# EAGLE design 242_arrayrelay (EAGLE 9.6.2)

## Sheet 1 of 4
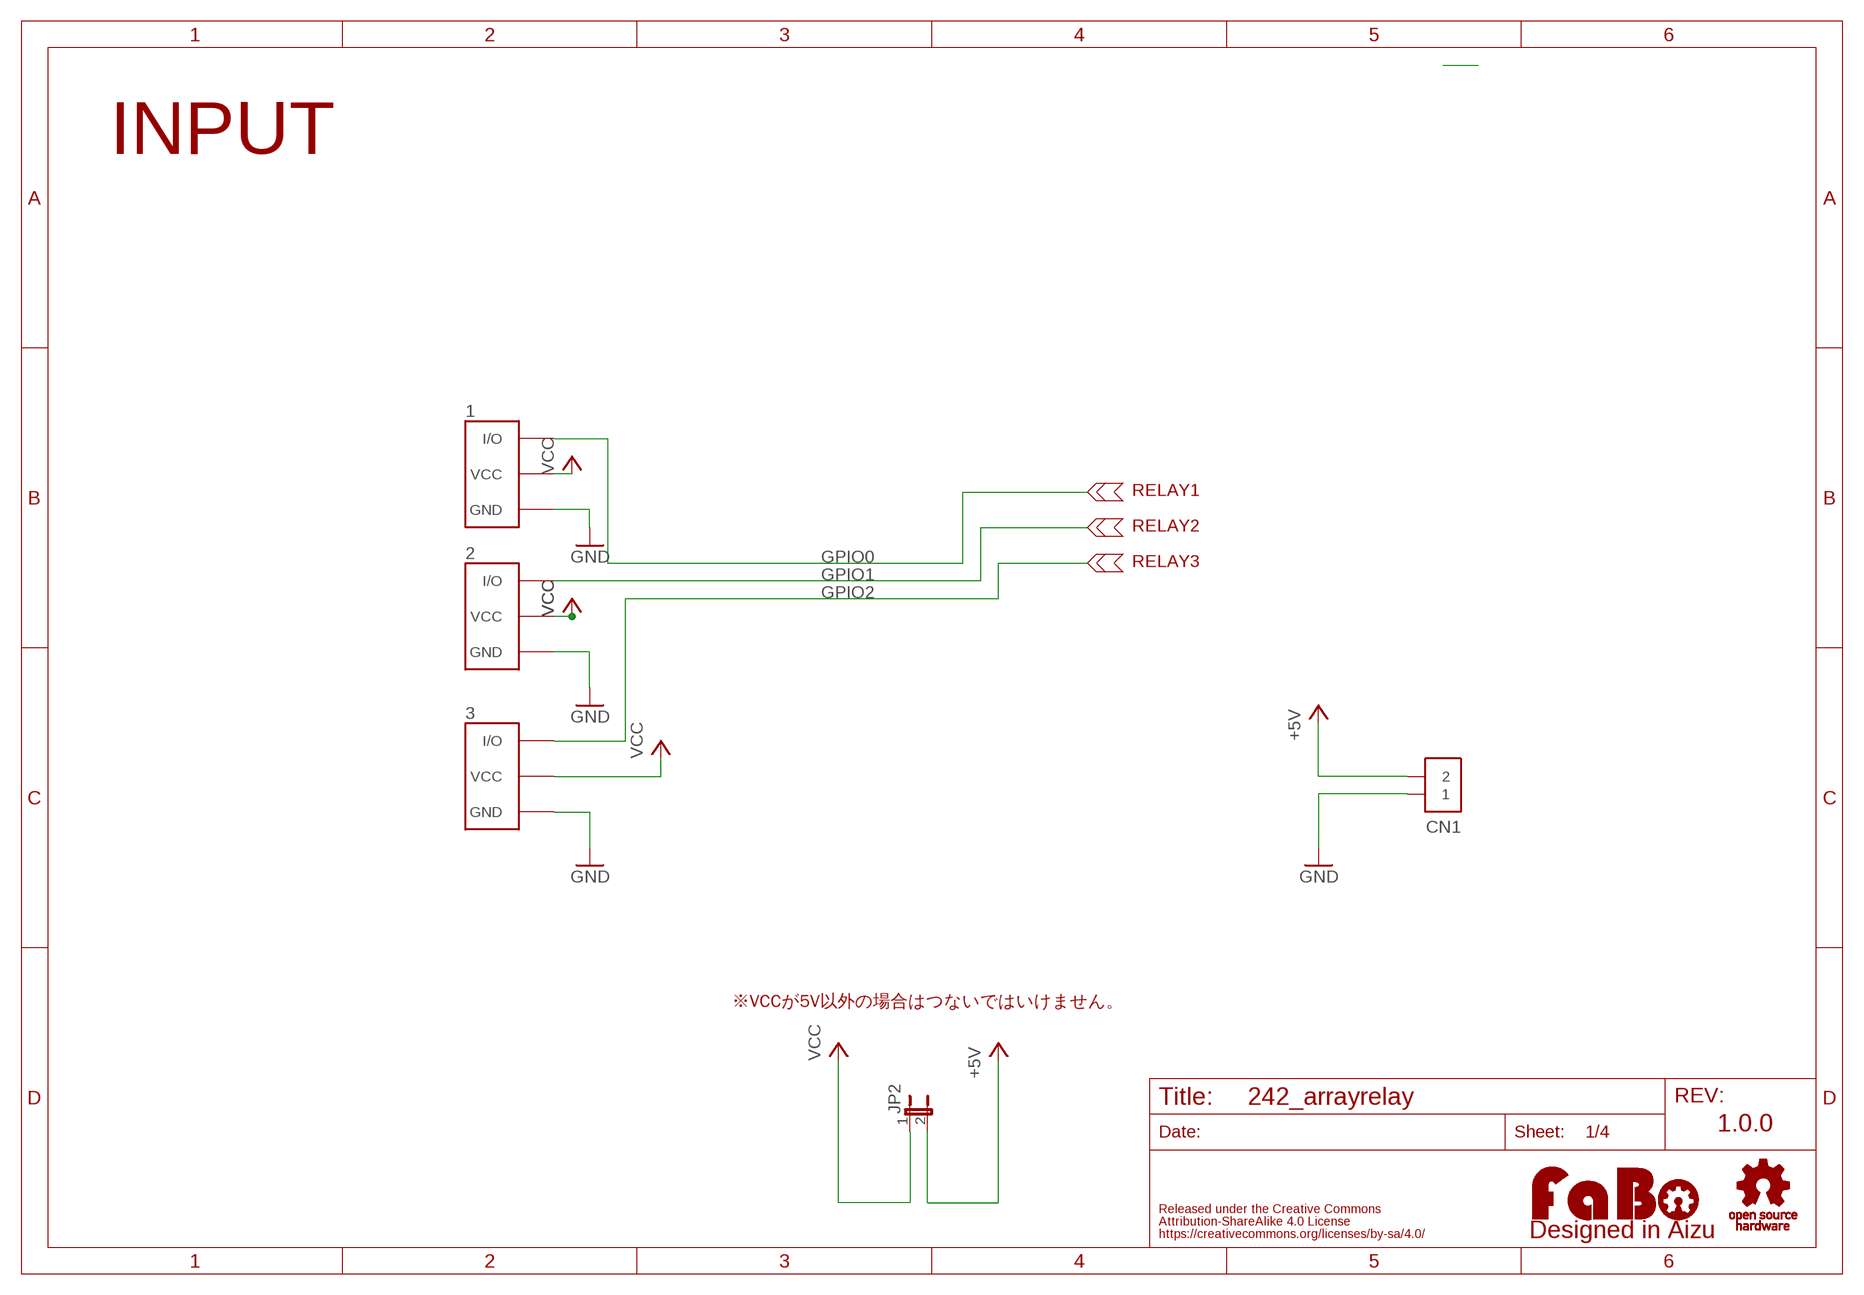
[diagram p0: schematic, sheet 1]

### Parts
1  FABO_BRICK_3PIN-S03B-PASK-2  [FABO_BRICK_3PIN_S03B-PASK-2]
2  FABO_BRICK_3PIN-S03B-PASK-2  [FABO_BRICK_3PIN_S03B-PASK-2]
3  FABO_BRICK_3PIN-S03B-PASK-2  [FABO_BRICK_3PIN_S03B-PASK-2]
CN1  PIN_HEADER_1X2  [PIN_1X2]
JP2  JP1E  [JP1]
LOGO1  LOGO_FABO-M  [LOGO_FABO_M]
U$2  LOGO_OSHW-M_BOTTOM  [LOGO_OSHW_M_BOTTOM]

### Nets
+5V: CN1.2 JP2.2 ; also sheet 2,3,4
GND: 1.GND 2.GND 3.GND CN1.1 ; also sheet 2,3,4
GPIO0: 1.I/O ; also sheet 2
GPIO1: 2.I/O ; also sheet 3
GPIO2: 3.I/O ; also sheet 4
VCC: 1.VCC 2.VCC 3.VCC JP2.1 ; also sheet 2,3,4

### Notes on the sheet
- INPUT
- RELAY1
- RELAY2
- RELAY3
- ※VCCが5V以外の場合はつないではいけません。
- 1.0.0

## Sheet 2 of 4
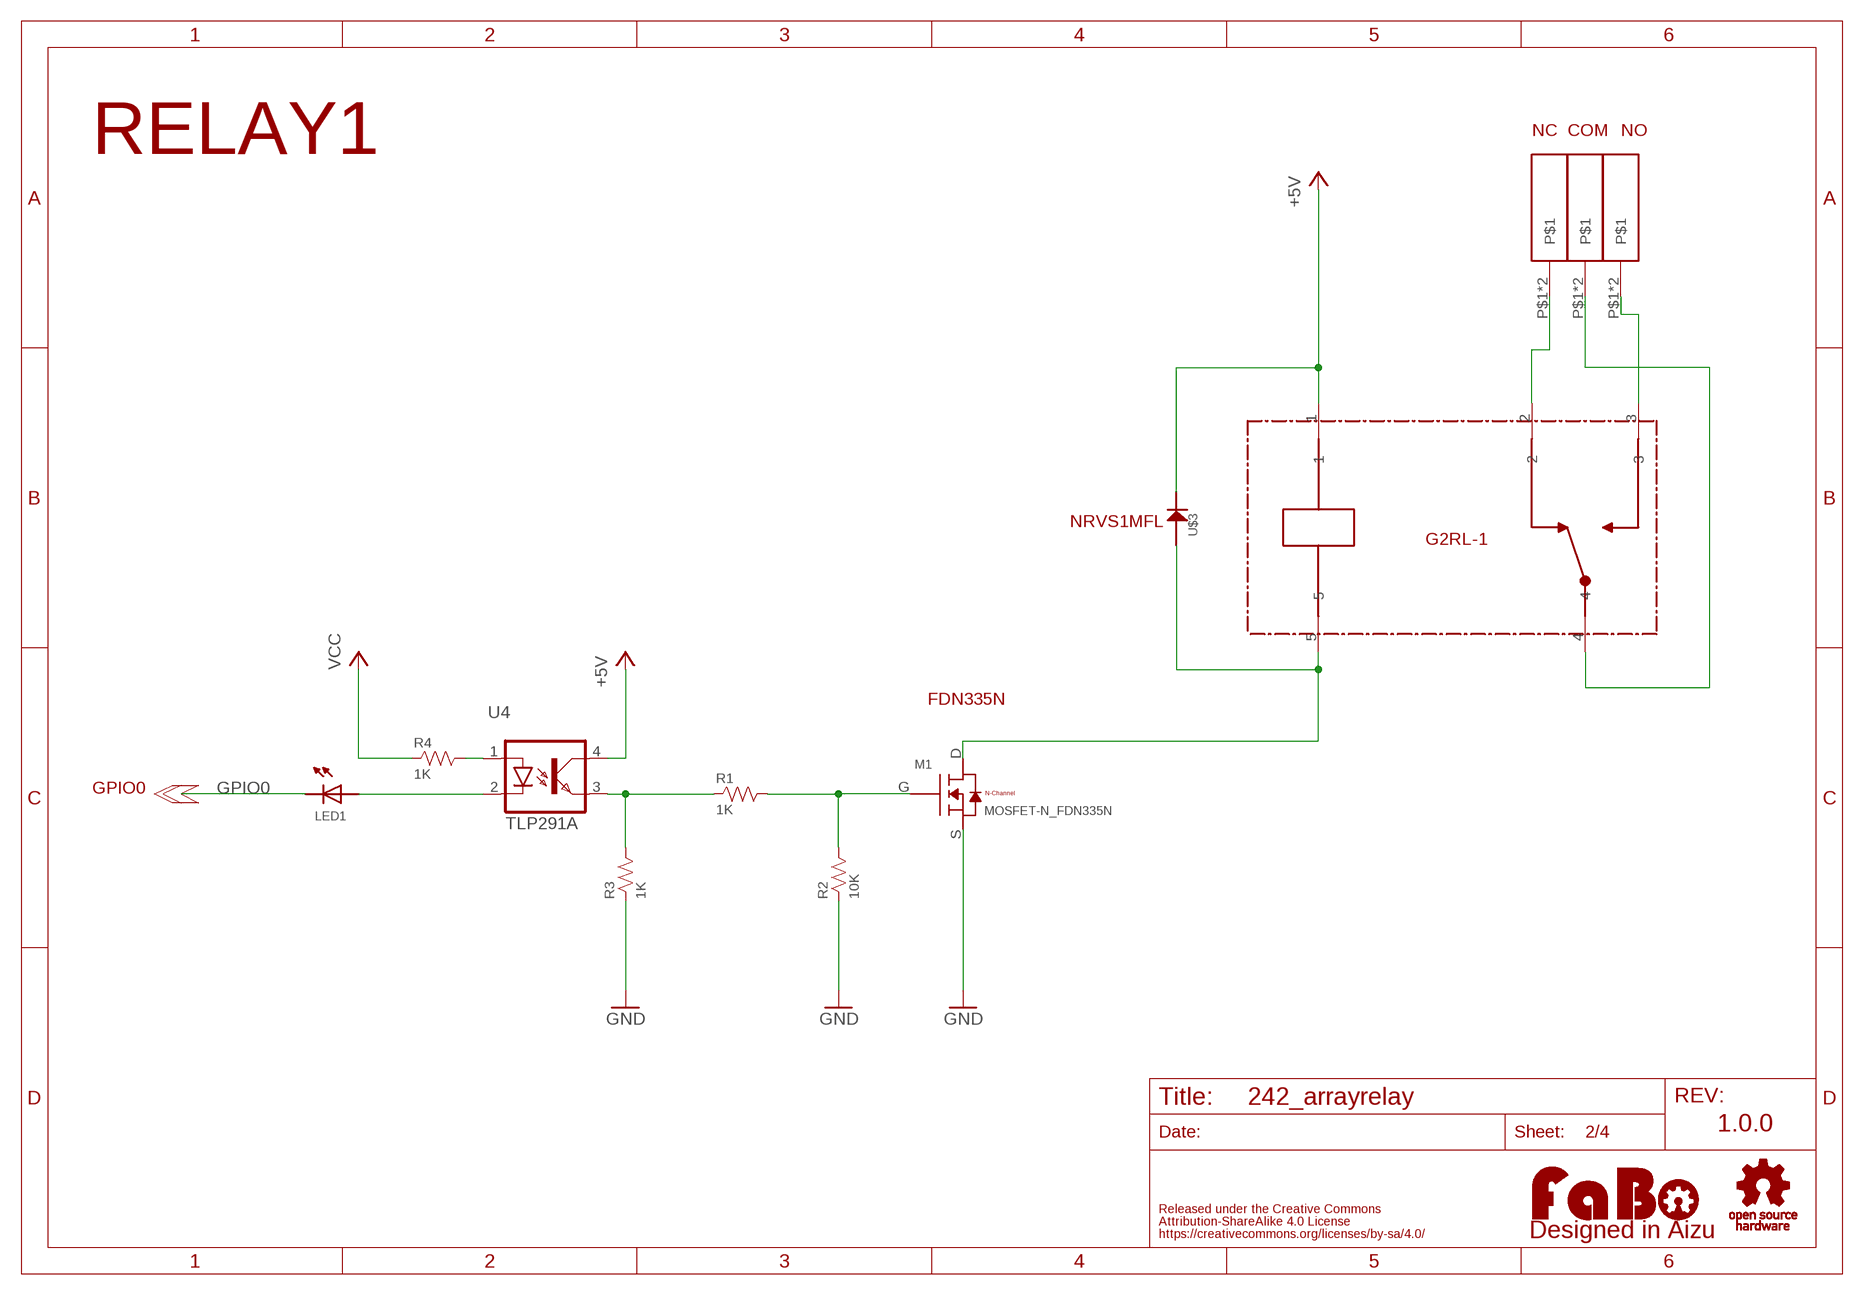
[diagram p1: schematic, sheet 2]

### Parts
COM1  TBL004-508  [TBL004-508]
LED1  LED-0402-NO_SILK  [0402-NO_SILK]
M1  MOSFET-N_FDN335N  [SUPERSOT-3]
NC1  TBL004-508  [TBL004-508]
R1  1K  RESISTOR-0603-NARROW  [0603-NARROW]
R2  10K  RESISTOR-0603-NARROW  [0603-NARROW]
R3  1K  RESISTOR-0603-NARROW  [0603-NARROW]
R4  1K  RESISTOR-0603-NARROW  [0603-NARROW]
RL1  G2RL-1  [G2RL-1]
U4  TLP291A  [11-3C1]
U$3  NRVS1MFL  [SD-123F]
U$7  TBL004-508  [TBL004-508]

### Nets
+5V: RL1.1 U4.4(COL) U$3.2(CATHODE) ; also sheet 1,3,4
GND: M1.S R2.1 R3.1 ; also sheet 1,3,4
GPIO0: LED1.CATHODE ; also sheet 1
N$2: M1.D RL1.5 U$3.1(ANODE)
N$3: R1.1 R3.2 U4.3(EMI)
N$4: M1.G R1.2 R2.2
N$5: LED1.ANODE U4.2(C)
N$7: R4.2 U4.1(A)
N$8: NC1.P$1 NC1.P$2 RL1.2
N$9: COM1.P$1 COM1.P$2 RL1.4
N$10: RL1.3 U$7.P$1 U$7.P$2
VCC: R4.1 ; also sheet 1,3,4

### Notes on the sheet
- NC | COM | NO
- RELAY1
- NRVS1MFL
- G2RL-1
- FDN335N
- GPIO0
- 1.0.0

## Sheet 3 of 4
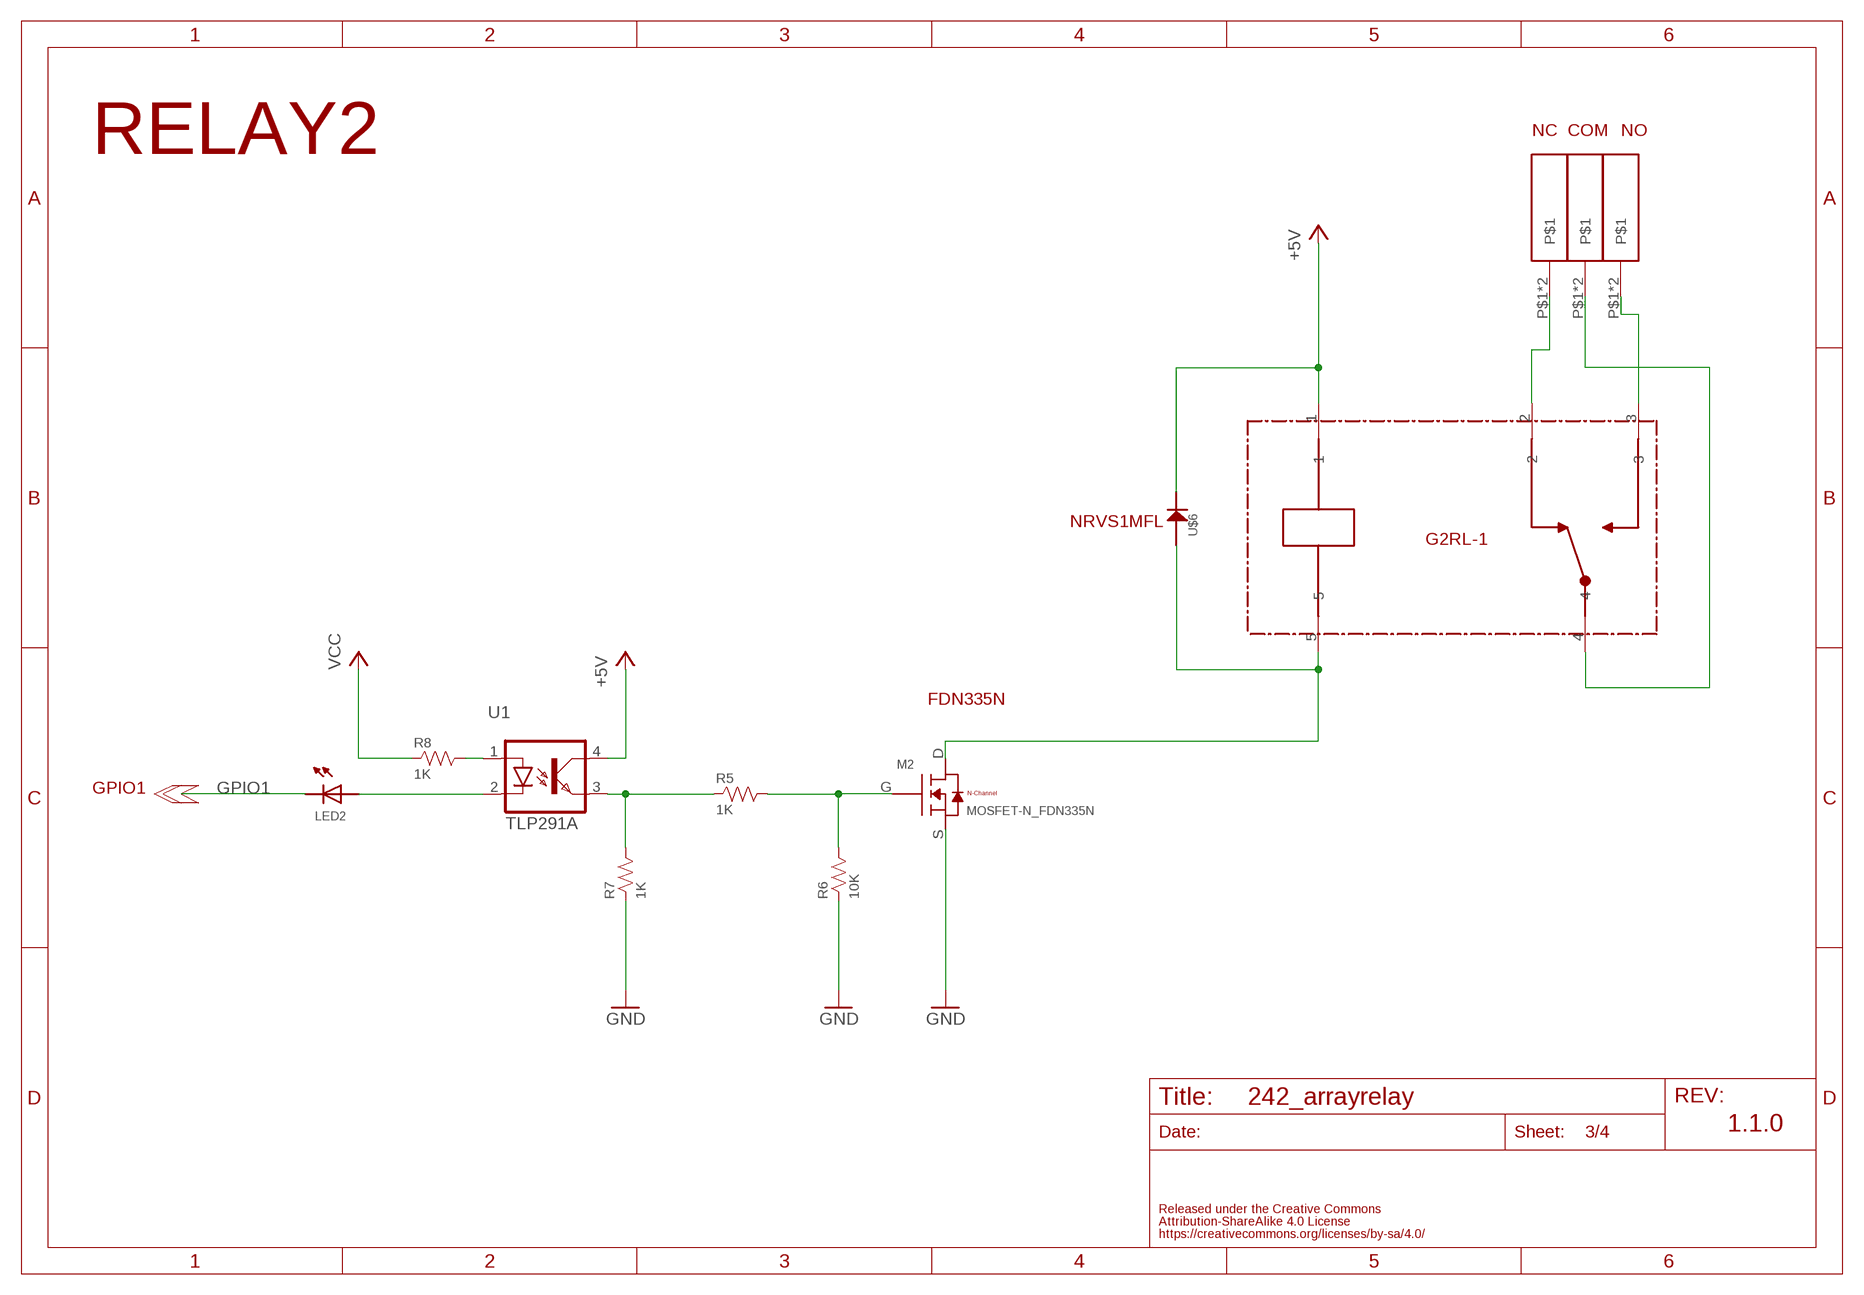
[diagram p2: schematic, sheet 3]

### Parts
COM2  TBL004-508  [TBL004-508]
LED2  LED-0402-NO_SILK  [0402-NO_SILK]
M2  MOSFET-N_FDN335N  [SUPERSOT-3]
NC2  TBL004-508  [TBL004-508]
R5  1K  RESISTOR-0603-NARROW  [0603-NARROW]
R6  10K  RESISTOR-0603-NARROW  [0603-NARROW]
R7  1K  RESISTOR-0603-NARROW  [0603-NARROW]
R8  1K  RESISTOR-0603-NARROW  [0603-NARROW]
RL2  G2RL-1  [G2RL-1]
U1  TLP291A  [11-3C1]
U$6  NRVS1MFL  [SD-123F]
U$9  TBL004-508  [TBL004-508]

### Nets
+5V: RL2.1 U1.4(COL) U$6.2(CATHODE) ; also sheet 1,2,4
GND: M2.S R6.1 R7.1 ; also sheet 1,2,4
GPIO1: LED2.CATHODE ; also sheet 1
N$6: M2.D RL2.5 U$6.1(ANODE)
N$11: R5.1 R7.2 U1.3(EMI)
N$12: M2.G R5.2 R6.2
N$13: NC2.P$1 NC2.P$2 RL2.2
N$14: COM2.P$1 COM2.P$2 RL2.4
N$15: RL2.3 U$9.P$1 U$9.P$2
N$16: LED2.ANODE U1.2(C)
N$17: R8.2 U1.1(A)
VCC: R8.1 ; also sheet 1,2,4

### Notes on the sheet
- NC | COM | NO
- RELAY2
- NRVS1MFL
- G2RL-1
- FDN335N
- GPIO1
- 1.1.0

## Sheet 4 of 4
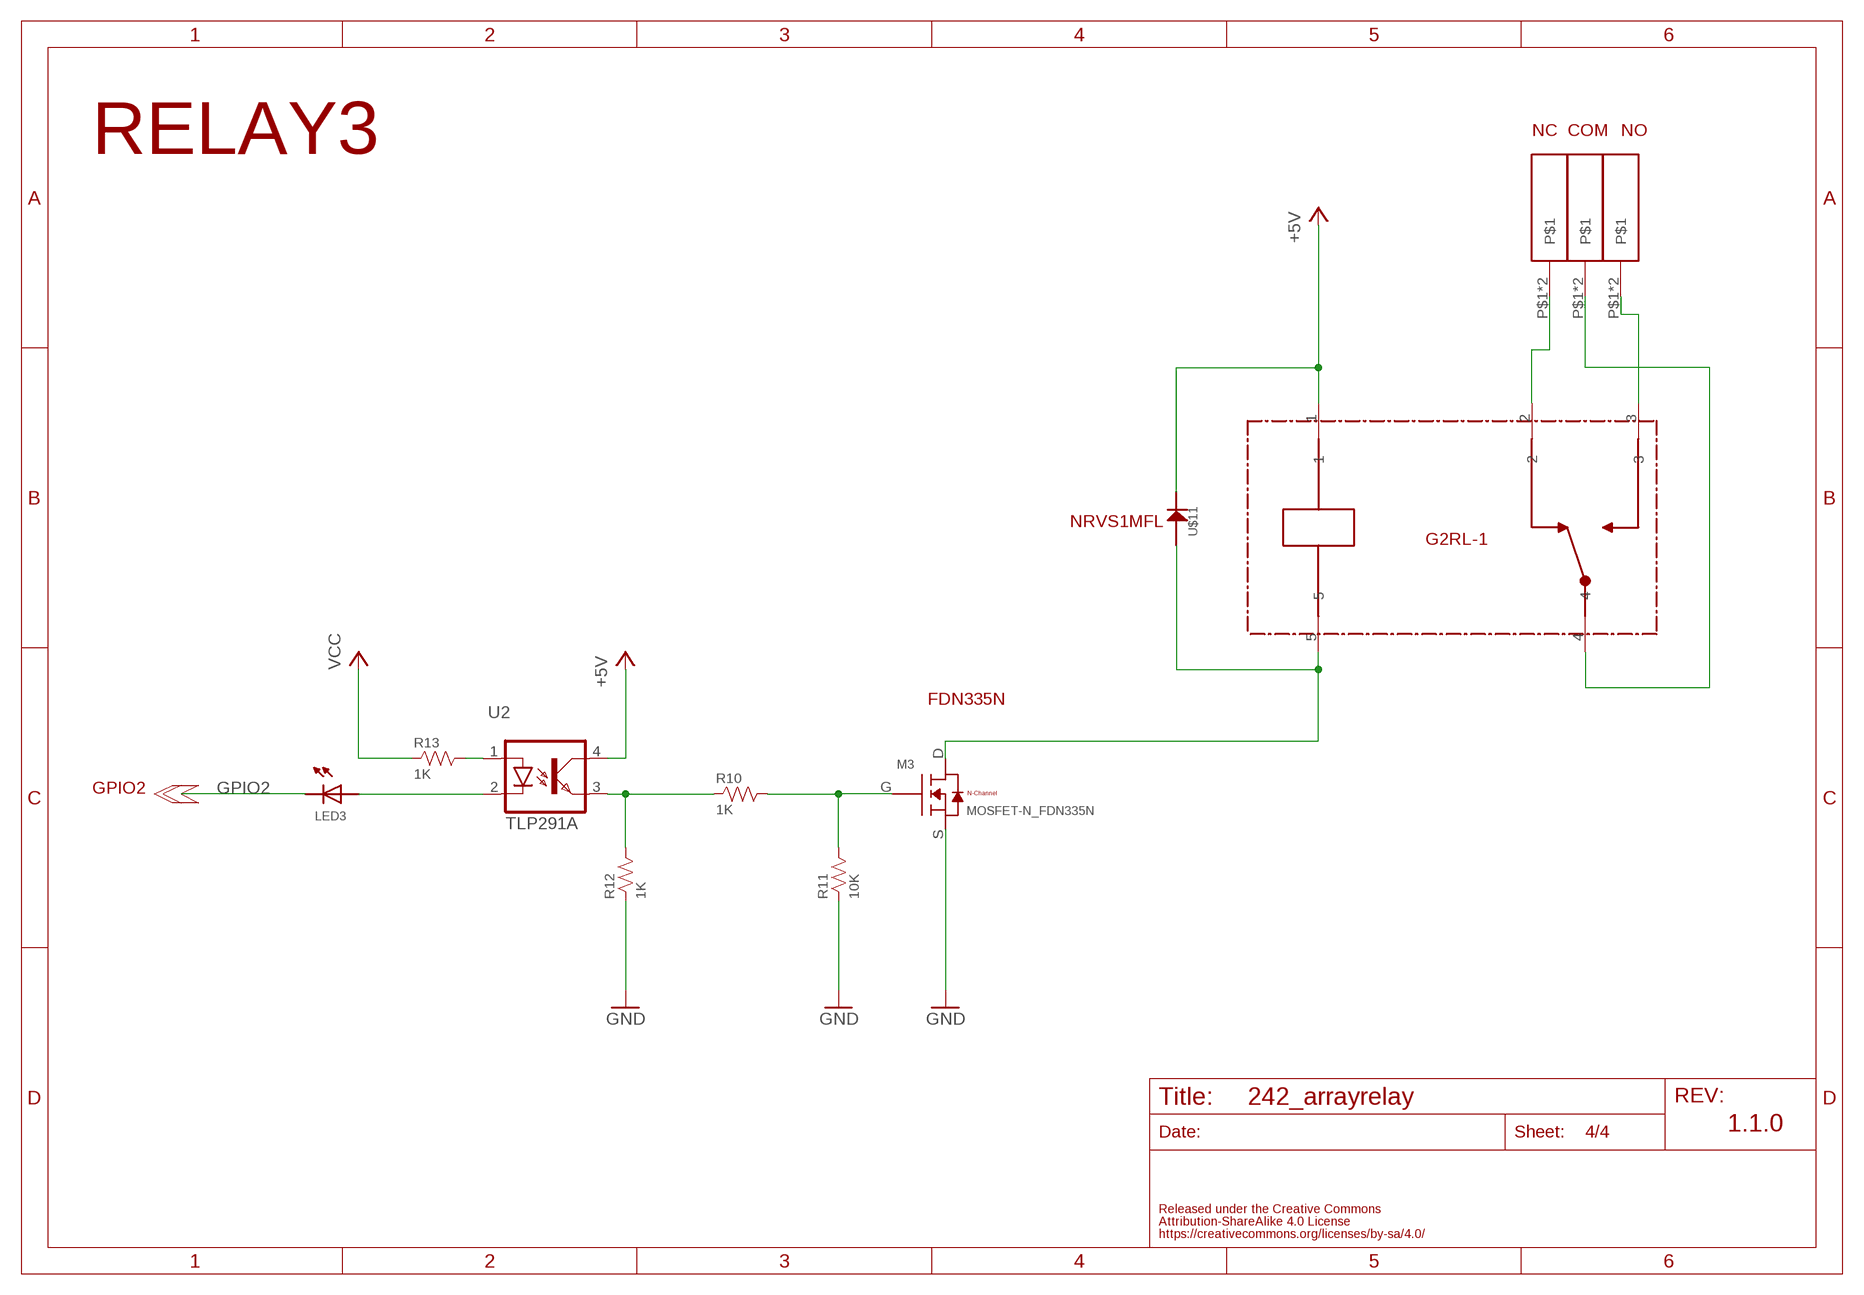
[diagram p3: schematic, sheet 4]

### Parts
COM3  TBL004-508  [TBL004-508]
LED3  LED-0402-NO_SILK  [0402-NO_SILK]
M3  MOSFET-N_FDN335N  [SUPERSOT-3]
NC3  TBL004-508  [TBL004-508]
R10  1K  RESISTOR-0603-NARROW  [0603-NARROW]
R11  10K  RESISTOR-0603-NARROW  [0603-NARROW]
R12  1K  RESISTOR-0603-NARROW  [0603-NARROW]
R13  1K  RESISTOR-0603-NARROW  [0603-NARROW]
RL3  G2RL-1  [G2RL-1]
U2  TLP291A  [11-3C1]
U$11  NRVS1MFL  [SD-123F]
U$12  TBL004-508  [TBL004-508]

### Nets
+5V: RL3.1 U2.4(COL) U$11.2(CATHODE) ; also sheet 1,2,3
GND: M3.S R11.1 R12.1 ; also sheet 1,2,3
GPIO2: LED3.CATHODE ; also sheet 1
N$18: M3.D RL3.5 U$11.1(ANODE)
N$19: R10.1 R12.2 U2.3(EMI)
N$20: M3.G R10.2 R11.2
N$21: NC3.P$1 NC3.P$2 RL3.2
N$22: COM3.P$1 COM3.P$2 RL3.4
N$23: RL3.3 U$12.P$1 U$12.P$2
N$24: LED3.ANODE U2.2(C)
N$25: R13.2 U2.1(A)
VCC: R13.1 ; also sheet 1,2,3

### Notes on the sheet
- NC | COM | NO
- RELAY3
- NRVS1MFL
- G2RL-1
- FDN335N
- GPIO2
- 1.1.0

## Library data of the parts
1-3 = FaBo-Template:FABO_BRICK_3PIN: FaBo Brick 3pin
CN1 = FaBo-PIN:PIN_HEADER_1X2
COM1-COM3 NC1-NC3 U$7 U$9 U$12 = FaBo-Terminal:TBL004-508
JP2 = jumper:JP1E: JUMPER
LED1-LED3 = FaBo-LED:LED
LOGO1 = component:LOGO_FABO
M1-M3 = FaBo-Mosfet:MOSFET-N
R1-R8 R10-R13 = FaBo-Resistors:RESISTOR: RESISTOR
RL1-RL3 = FaBo-Relay:G2RL-1
U1 U2 U4 = FaBo_Photocoupler:TLP291A
U$2 = component:LOGO_OSHW
U$3 U$6 U$11 = FaBo-Diode:NRVS1MFL

## Board
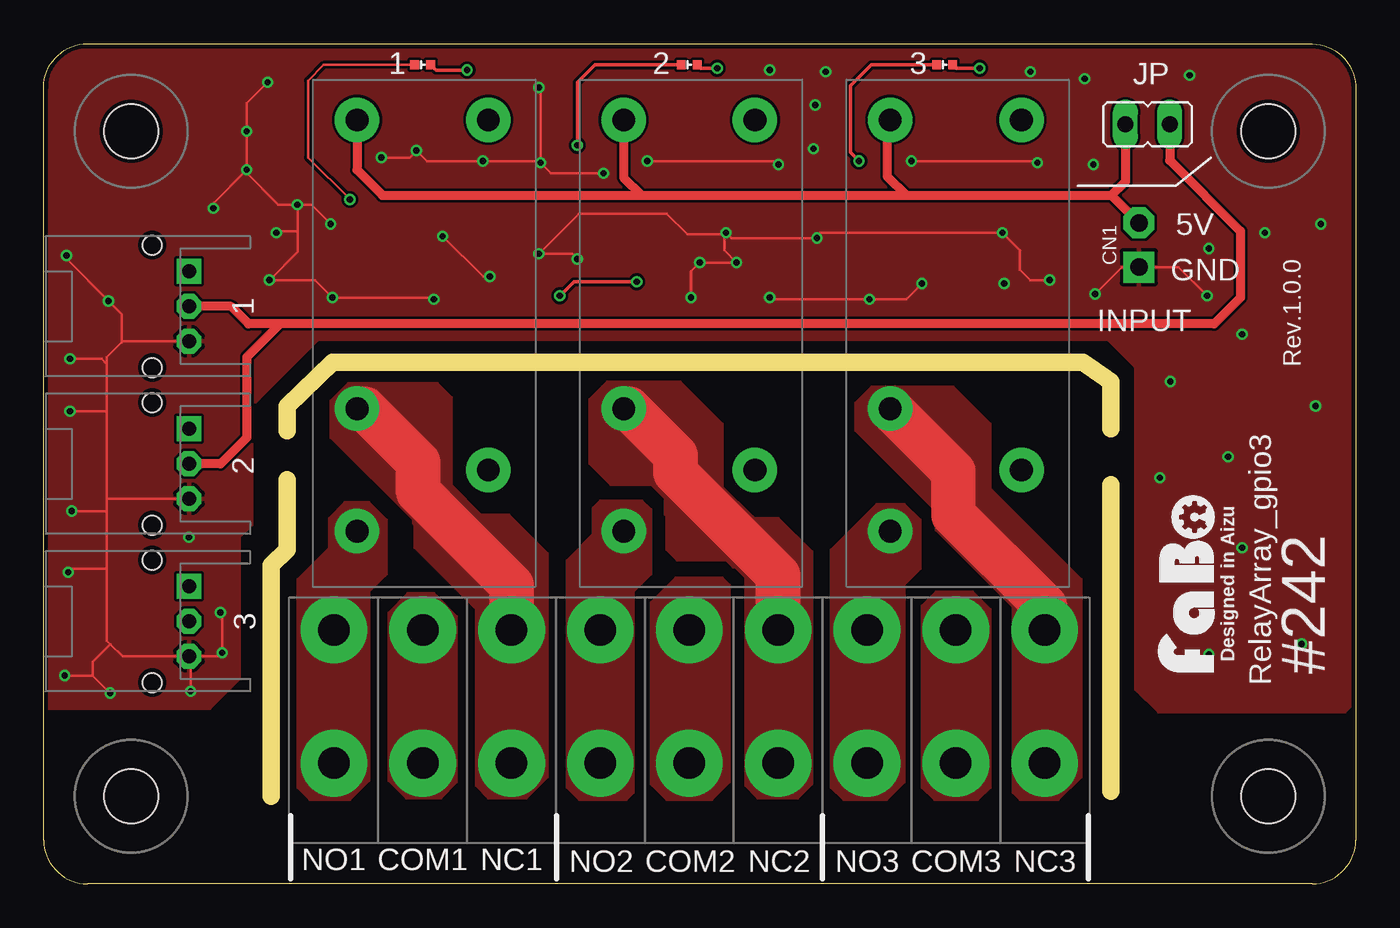
[diagram p4: board, top side]
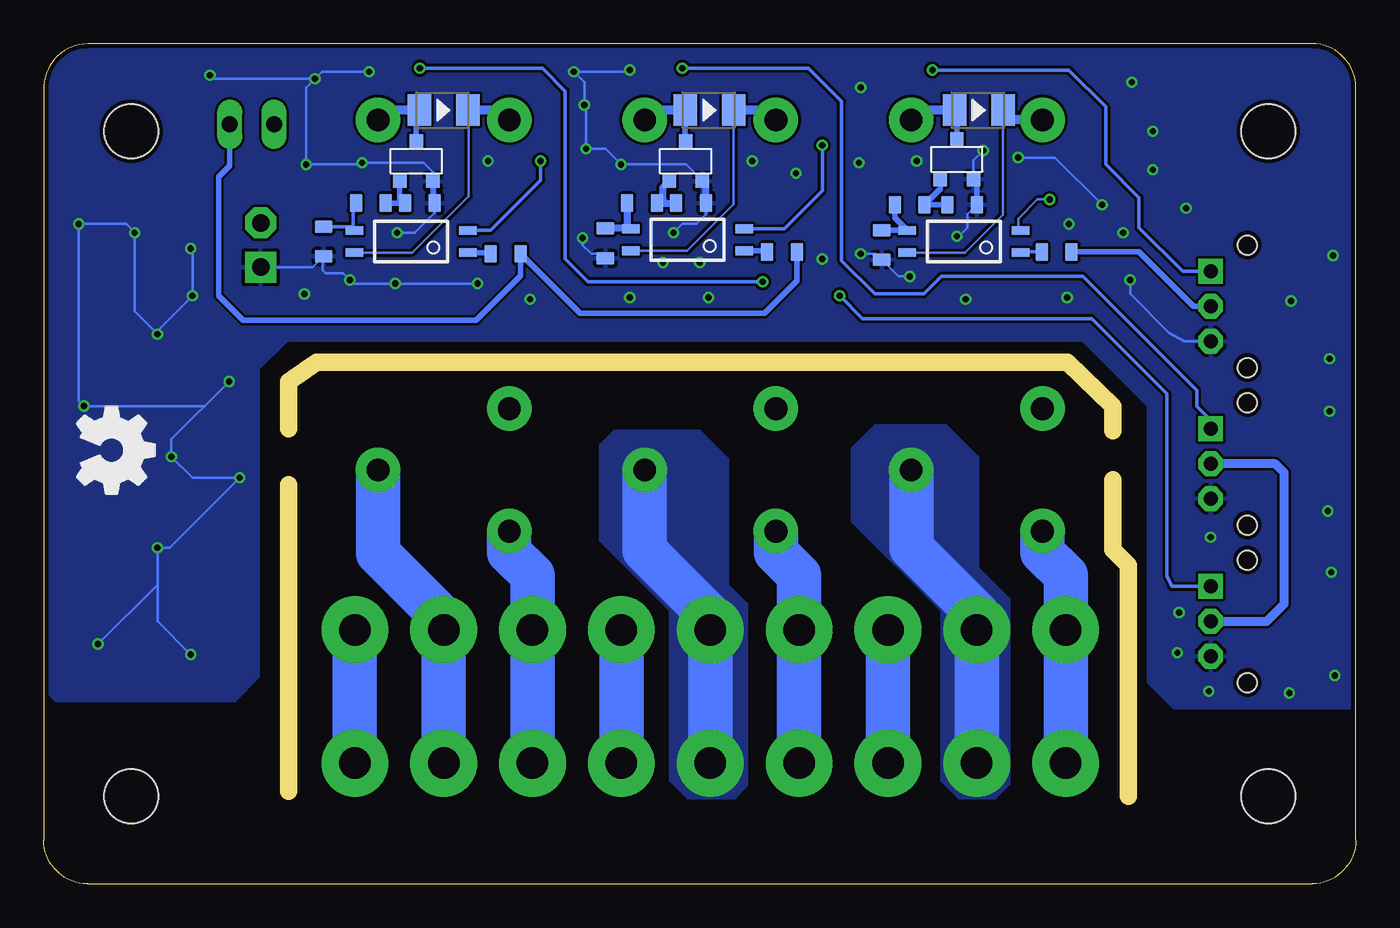
[diagram p5: board, bottom side, seen from below]

Size 75 x 48 mm. Coordinates in mm from the lower left corner, seen from the top.
Outline: 0,2.5 0,45.5 arc-90 2.5,48 72.5,48 arc-90 75,45.4 75,2.5 arc-90 72.5,0 2.5,0 arc-90 0,2.5
Copper layers (1*16): Top 0.035mm / dielectric 1.6mm / Bottom 0.035mm
Design rules "PCBway": minimum track width 6mil, minimum drill 12mil, track to track 6mil, track to pad 6mil, pad to pad 6mil, via to via 6mil, smd to smd 6mil, copper to edge 10mil, drill to drill 10mil, minimum pad ring 10mil, minimum via ring 6mil, stop-mask expansion 2mil, vias tented up to drill 100mil, thermal gap 8mil
Holes 3.1 mm at 5,5 5,43 70,43 70,5
Milling: 9 lines

### Footprints (pad centres in the part's own frame; a part is rotated, then mirrored left to right if it is on the bottom)
FABO_BRICK_3PIN_S03B-PASK-2 = drill 0.8 pad 1.422 octagon: GND -2,0; VCC 0,0 | drill 0.8 pad 1.422 square: I/O 2,0 | hole 1.1: 3.5,2.1; -3.5,2.1
PIN_1X2 = drill 1 pad 1.778 square: 1 -1.27,0 | drill 1 pad 1.778 octagon: 2 1.27,0
TBL004-508 = drill 1.8 pad 3.81: P$1 0,3.81; P$2 0,-3.81
JP1 = drill 0.914 long: 1 0,-1.27; 2 0,1.27
0402-NO_SILK = smd 0.5 x 0.5: ANODE -0.46,0; CATHODE 0.46,0
SUPERSOT-3 = smd 0.76 x 0.76: D 0,1.15; G -0.95,-1.15; S 0.95,-1.15
0603-NARROW = smd 0.71 x 1: 1 -0.85,0; 2 0.85,0
G2RL-1 = drill 1.3 pad 2.54: 1 -11.75,-3.75; 2 4.75,-3.75; 3 11.75,-3.75; 4 8.25,3.75; 5 -11.75,3.75
11-3C1 = smd 1 x 0.5: 1 -3.24,0.635; 2 -3.24,-0.635; 3 3.24,-0.635; 4 3.24,0.635
SD-123F = smd 1.34 x 1.8: 1 -1.33,0; 2 1.43,0

### Placement (x,y rotation side)
1  8.3,33 90 top
2  8.3,24 90 top
3  8.3,15 90 top
CN1  62.6,36.5 90 top
COM1  21.66,10.7 0 top
COM2  36.9,10.7 0 top
COM3  52.14,10.7 0 top
JP2  63.1,43.4 90 top
LED1  21.66,46.8 0 top
LED2  36.9,46.8 0 top
LED3  51.5,46.8 0 top
LOGO1  67.31,17.14 90 top
M1  22.8,41.4 0 bottom
M2  38.3,41.3 0 bottom
M3  53.7,41.3 0 bottom
NC1  26.74,10.7 0 top
NC2  41.98,10.7 0 top
NC3  57.22,10.7 0 top
R1  25.5,38.8 0 bottom
R2  22.5,38.8 180 bottom
R3  27.1,36.5 90 bottom
R4  17.1,36.1 180 bottom
R5  40.8,38.9 0 bottom
R6  38,38.9 180 bottom
R7  42.9,36.6 90 bottom
R8  32.8,36.1 180 bottom
R10  56.3,38.9 0 bottom
R11  53.5,38.9 180 bottom
R12  59,36.7 90 bottom
R13  48.6,36 180 bottom
RL1  21.66,31.9 270 top
RL2  36.9,31.9 270 top
RL3  52.14,31.9 270 top
U1  38.2,36.8 180 bottom
U2  54,36.7 180 bottom
U4  22.4,36.7 180 bottom
U$2  71.12,24.77 90 top
U$3  21.6,44.2 0 bottom
U$6  37,44.2 0 bottom
U$7  16.58,10.7 0 top
U$9  31.82,10.7 0 top
U$11  52.2,44.2 0 bottom
U$12  47.06,10.7 0 top

### Tracks (layer width: path | path; a pad name or v marks a point on that pad's centre or on a via)
+5V
  Top 0.508: RL2.1 33.15,40.35 34.17,39.33 | RL1.1 17.91,40.79 19.37,39.33 34.17,39.33 | 61.04,39.33 CN1.2 | 34.17,39.33 49.3,39.33 | 49.3,39.33 61.04,39.33 | JP2.2 61.83,40.12 61.04,39.33 | 49.3,39.33 48.2,40.43 48.2,43.46 RL3.1
  Bottom 0.152: U1.4 38.23,36.16 35.57,38.83 U$6.2 | U2.4 53.94,36.06 50.7,39.3 50.7,44.13 U$11.2 | U$3.2 20.17,38.23 22.34,36.06 U4.4
  Bottom 0.508: RL1.1 19.62,43.65 U$3.2 | RL2.1 33.15,44.2 U$6.2 | RL3.1 48.39,44.2 U$11.2
GND  (via drill 0.35)
  Top 0.152: 3.GND 4.5,13 3.8,13.7 | 3.8,13.7 3.6,13.9 3.6,18 | 3.6,18 3.6,21.2 | 3.6,21.2 3.6,22 | 3.6,22 2.GND | 3.6,29.7 3.6,30.1 4.45,30.95 | 3.6,29.7 3.6,27.1 | 3.6,27.1 3.6,22 | v22.8,37 25.1,34.7 v25.5,34.7 | 14.5,37.3 14.5,36.1 v12.9,34.5 15.5,34.5 v16.5,33.5 22.2,33.5 v22.3,33.4 | 14.5,37.3 v14.5,38.8 | v19.3,41.5 20.9,41.5 v21.3,41.9 21.9,41.3 v25.1,41.3 28.3,41.3 v28.4,41.2 | 38.9,37.1 36.8,37.1 35.6,38.3 30.6,38.3 v28.3,36 30.2,36 v30.5,35.7 | 38.9,37.1 v39,37.2 39.3,36.9 44.1,36.9 | v44.2,36.9 44.1,36.9 | 44.1,36.9 44.4,37.2 v54.8,37.2 55.8,36.2 55.8,35.1 56.4,34.5 v57.5,34.5 | 4.45,30.95 4.5,31 1.GND | v8.4,11 8.4,12.9 3.GND | 3.GND 10,13 v10.2,13.2 10.2,15.4 v10.1,15.5 | v3.8,10.9 2.8,11.9 | 2.8,11.9 v1.2,11.9 | 2.8,11.9 2.8,12.7 3.8,13.7 | v1.4,17.8 1.6,18 3.6,18 | v1.6,21.3 3.5,21.3 3.6,21.2 | v1.5,27 3.5,27 3.6,27.1 | v1.5,30 3.3,30 3.6,29.7 | v1.3,35.9 1.3,35.7 v3.7,33.3 4.45,32.55 4.45,30.95 | v9.7,38.6 9.7,38.9 11.5,40.7 | 11.5,40.7 v11.6,40.8 v11.6,43 11.6,44.6 v12.8,45.8 | v13.3,37.2 13.4,37.3 14.5,37.3 | v14.5,38.8 13.4,38.8 11.5,40.7 | v14.5,38.8 15.3,38.8 v16.4,37.7 | v28.3,45.5 28.4,45.4 v28.4,41.2 | v28.4,41.2 29,40.6 v32,40.6 | v34.5,41.3 41.8,41.3 v42,41.1 | v49.6,41.3 56.7,41.3 v56.8,41.2 | v50.2,34.3 49.3,33.4 v47.2,33.4 41.6,33.4 v41.5,33.5 | v37,33.5 37,35 v37.5,35.5 v39.6,35.5 38.9,36.2 38.9,37.1 | v66.5,33.6 64.87,35.23 CN1.1 61.63,35.23 v60.1,33.7
  Bottom 0.152: 42.7,35.55 R7.1 43.15,36 43.7,36 44.2,36.5 v44.2,36.9 | 21.75,40.15 M1.S 21.85,41.35 v21.3,41.9 | R3.1 26.95,35.8 | 37.45,39.2 R6.1 37.15,38.25 37.7,37.7 38.5,37.7 v39,37.2 | v22.8,37 22.7,37 22.2,37.5 22.2,38.25 R2.1 | v25.5,34.7 26.15,34.7 R3.1 | 1.GND 9.81,31 10.7,31.5 12.9,33.7 v12.9,34.5 | v14.5,38.8 17.2,41.5 v19.3,41.5 | R3.1 27.45,36 v28.3,36 | R11.1 52.65,38.35 53.8,37.2 v54.8,37.2 | CN1.1 59.62,35.23 R12.1 59.05,35.8 59.05,35.05 58.9,34.9 57.9,34.9 v57.5,34.5 57.3,34.3 v54.9,34.3 v50.2,34.3 | M2.S 38.3,41.1 v42,41.1 42.9,42 v44,42 44,44.4 v44.1,44.5 44.1,45.8 v44.7,46.4 41.6,46.4 v41.5,46.5 | v56.4,46.4 59.1,46.4 v59.5,46 | v59.5,46 65.3,46 v65.5,46.2 | v59.5,46 60,45.5 v60,41.1 56.9,41.1 v56.8,41.2 53.3,41.2 52.75,40.65 M3.S | 68.5,17.1 v68.5,19.2 67.8,19.2 v63.8,23.2 66.5,23.2 v67.7,24.4 67.7,25.4 v64.4,28.7 65.8,27.3 v72.7,27.3 73,27.6 v73,37.7 70.3,37.7 v69.8,37.2 69.8,32.7 v68.5,31.4 68.5,31.6 v66.5,33.6 66.5,36.2 v66.6,36.3 | 68.5,17.1 68.5,15 v66.6,13.1 | v71.9,13.7 68.5,17.1
  Bottom 0.305: R2.1 21.65,40.05 M1.S | M3.S 52.75,38.9 R11.1
  Bottom 0.406: R6.1 37.15,39.95 M2.S
  other vias: 8.3,19.8
  pour Bottom: -2.5,12.6 0.1,10 10.4,10 11.9,11.5 11.9,27.3 15.6,31 61.1,31 62.7,29.4 62.7,11.8 64.1,10.4 74.3,10.4 76.1,12.2 76.1,47.9 73.2,50.8 2.2,50.8 -2.5,46.1
  pour Top: -2.8,12.7 -2.8,46.2 2.1,51.1 73.5,51.1 76.6,48 76.6,12 74.4,9.8 63.7,9.8 62.4,11.1 62.4,29.5 60.8,31.1 15.7,31.1 11.9,27.3 11.9,20.5 11.2,19.8 11.2,11.7 9.5,10 -0.1,10
GPIO0  (via drill 0.35)
  Top 0.203: v24.2,46.5 22.42,46.5 LED1.CATHODE
  Bottom 0.203: v24.2,46.5 16.4,46.5 14.3,44.4 14.3,41.1 12.4,39.2 12.4,37.5 9.9,35 1.I/O
GPIO1  (via drill 0.35)
  Top 0.203: v38.5,46.6 37.56,46.6 LED2.CATHODE
  Bottom 0.203: v38.5,46.6 31.3,46.6 29.4,44.7 29.4,35.6 27.5,33.7 24.7,33.7 23.7,34.7 15.6,34.7 9.1,28.2 9.1,27.3 8.3,26.5 2.I/O
GPIO2  (via drill 0.35)
  Top 0.203: v53.5,46.6 52.16,46.6 LED3.CATHODE | v29.5,33.6 30.3,34.4 v33.9,34.4
  Bottom 0.203: 3.I/O 10.53,17 10.8,17.59 10.8,28 15.1,32.3 28.2,32.3 v29.5,33.6 | v53.5,46.6 46.5,46.6 45.2,45.3 45.2,35.7 43.9,34.4 v33.9,34.4
N$2
  Bottom 0.305: M1.D 22.8,44.07 U$3.1
  Bottom 0.508: U$3.1 24.86,44.2 RL1.5
N$3
  Bottom 0.305: R1.1 26.35,38.05 U4.3 27.09,37.34 R3.2
N$4
  Bottom 0.152: M1.G 23.45,39.95
  Bottom 0.305: M1.G 23.75,39.7 R1.2 R2.2
N$5  (via drill 0.35)
  Top 0.152: LED1.ANODE 16,46.8 15.1,45.9 15.1,41.5 v17.5,39.1
  Bottom 0.152: v17.5,39.1 18.2,39.1 19.3,38 19.3,37.48 U4.2
N$6
  Bottom 0.305: U$6.1 38.33,42.45 M2.D
  Bottom 0.508: U$6.1 40.65,44.2 RL2.5
N$7
  Bottom 0.152: U4.1 18.68,36.06
  Bottom 0.203: R4.2 19.12,36.1 U4.1
N$8
  Top 2.54: NC1.P$1 26.74,17.06 21.4,22.4 21.4,24.1 18.35,27.15 RL1.2
  Bottom 2.54: NC1.P$1 NC1.P$2
  pour Top (no thermals): 16.4,25.5 16.4,27.6 17.4,28.6 22.5,28.6 23.3,27.8 23.3,22.8 25,21.1 26.6,21.1 28.8,18.9 28.8,6.1 27.6,4.9 25.4,4.9 24.7,5.6 24.7,15.7 21.2,19.2 21.2,20.5 21.1,20.6 21.1,20.8
N$9
  Bottom 2.54: COM1.P$2 COM1.P$1 21.66,15.46 25.41,19.21 RL1.4
  pour Top (no thermals): 20.7,4.9 19.7,5.9 19.7,15.5 20.8,16.6 22.3,16.6 23.6,15.3 23.6,5.8 22.7,4.9
  pour Bottom (no thermals): 19.8,5.9 19.8,16.3 21.6,18.1 21.6,24.4 23.4,26.2 27.5,26.2 28.8,24.9 28.8,20.7 23.7,15.6 23.7,5.9 22.8,5 22.7,4.9 20.6,4.9 19.8,5.7
N$10
  Bottom 2.54: U$7.P$2 U$7.P$1 16.58,17.62 17.91,18.95 RL1.3
  pour Top (no thermals): 14.5,6.2 14.5,17.4 16.3,19.2 16.3,20.9 17.2,21.8 17.9,21.8 18.6,21.8 19.6,20.8 19.6,17.7 19.5,17.6 18.6,16.7 18.6,5.9 17.5,4.8 15.2,4.8 14.5,5.5
N$11
  Bottom 0.152: R5.1 41.65,38.4 | 42.76,37.45 R7.2
  Bottom 0.406: 42.76,37.45 41.45,37.45 U1.3 41.65,37.65 R5.1
N$12
  Bottom 0.152: R5.2 39.62,39.23 | 39.62,38.92 39.45,39.1
  Bottom 0.406: R5.2 R6.2 | M2.G 39.62,39.77 39.62,39.23 39.62,38.92
N$13
  Top 2.54: NC2.P$1 41.98,17.62 36.1,23.5 36.1,24.5 33.45,27.15 RL2.2
  Bottom 2.54: NC2.P$1 NC2.P$2
  pour Top (no thermals): 31.2,25.5 31.2,27.7 31.9,28.4 32.2,28.7 34.1,28.7 36.4,28.7 38.8,26.3 38.8,22.7 40.5,21 40.6,20.9 42,20.9 43.9,19 43.9,6 43.9,5.7 43.1,4.9 40.8,4.9 40.1,5.6 40.1,17.5 39.5,18.1 39.4,18.1 39,18.5 36.2,18.5 35.6,19.1 35.6,21 35.5,21.1 35.5,22 34.7,22.8 32.4,22.8 31.2,24
N$14
  Bottom 2.54: COM2.P$2 COM2.P$1 36.9,15.3 40.65,19.05 RL2.4
  pour Bottom (no thermals): 34.8,6.2 34.8,16 35.9,17.1 35.9,24.3 37.5,25.9 42.4,25.9 43.2,25.1 43.2,19.6 39.2,15.6 39.2,5.9 38.4,5.1 38.2,4.9 35.5,4.9 34.8,5.6
  pour Top (no thermals): 34.8,5.6 35.6,4.8 38.2,4.8 39.2,5.8 39.2,5.9 39.2,17.1 38.8,17.5 36.1,17.5 34.7,16.1 34.7,5.7
N$15
  Bottom 2.54: U$9.P$2 U$9.P$1 31.82,17.62 33.15,18.95 RL2.3
  pour Top (no thermals): 33.3,4.8 30.6,4.8 29.9,5.5 29.9,18.5 31.4,20 31.4,21.5 31.8,21.9 34.2,21.9 34.7,21.4 34.7,17.7 33.7,16.7 33.7,5.2
N$16  (via drill 0.35)
  Top 0.203: v30.5,42.2 30.5,45.8 31.5,46.8 LED2.ANODE
  Bottom 0.203: U1.2 32.66,37.44 30.5,39.6 v30.5,42.2
N$17
  Bottom 0.305: R8.2 33.65,36.16 U1.1
N$18
  Bottom 0.305: U$11.1 53.7,44.2 M3.D
  Bottom 0.508: U$11.1 55.89,44.2 RL3.5
N$19
  Bottom 0.203: U2.3 57.3,37.4 | 57.3,37.4 57.45,37.55 R12.2 | R10.1 57.3,38.75 57.3,37.4
N$20
  Bottom 0.152: 54.45,39 R11.2
  Bottom 0.305: M3.G 54.65,38.9 R11.2 R10.2
N$21
  Top 2.54: NC3.P$1 57.22,15.88 52,21.1 52,23.54 RL3.2
  Bottom 2.54: NC3.P$1 NC3.P$2
  pour Top (no thermals): 46.4,25.9 46.4,27.5 47.3,28.4 52,28.4 54.1,26.3 54.1,22.6 59.3,17.4 59.3,6.1 58,4.8 55.8,4.8 55.4,5.2 55.4,15.8 51,20.2 51,21.3
N$22
  Bottom 2.54: COM3.P$2 COM3.P$1 52.14,15.14 55.89,18.89 RL3.4
  pour Top (no thermals): 50.2,5.5 50.9,4.8 53.4,4.8 54.1,5.5 54.1,15.7 53.1,16.7 51,16.7 50.2,15.9
N$23
  Bottom 2.54: U$12.P$2 U$12.P$1 47.06,17.62 48.39,18.95 RL3.3
  pour Top (no thermals): 45,5.5 45.7,4.8 48.2,4.8 49.2,5.8 49.2,17.1 50.1,18 50.1,20.8 49.2,21.7 47.6,21.7 45,19.1
N$24  (via drill 0.35)
  Top 0.152: LED3.ANODE 51.2,46.8
  Top 0.203: v46.6,41.3 46.1,41.8 46.1,45.6 47.3,46.8 LED3.ANODE
  Bottom 0.203: U2.2 49.47,37.34 46.6,40.2 v46.6,41.3
N$25
  Bottom 0.305: R13.2 49.52,36.06 U2.1
VCC
  Top 0.508: JP2.1 64.37,41.33 68.4,37.3 68.4,33.5 66.9,32 13.5,32 | 1.VCC 10.7,33 11.7,32 13.5,32 | 13.5,32 11.6,30.1 11.6,25.5 10.1,24 2.VCC
  Bottom 0.305: 1.VCC 9.3,33 12.4,36.1 R4.1 | JP2.1 64.37,41.03 65,40.4 65,33.6 63.6,32.2 50.3,32.2 47.75,34.75 R13.1 44.35,32.6 33.8,32.6 31.95,34.45 R8.1
  Bottom 0.508: 3.VCC 5.1,15 4.1,16 4.1,23.5 4.6,24 2.VCC

### Text on the board
tPlace: 1 | 2 | 3 | JP | 5V | GND | INPUT | Rev.1.0.0 | Designed in Aizu | #242 | RelayArray_gpio3 | NO1 | COM1 | NC1 | NO2 | COM2 | NC2 | NO3 | COM3 | NC3